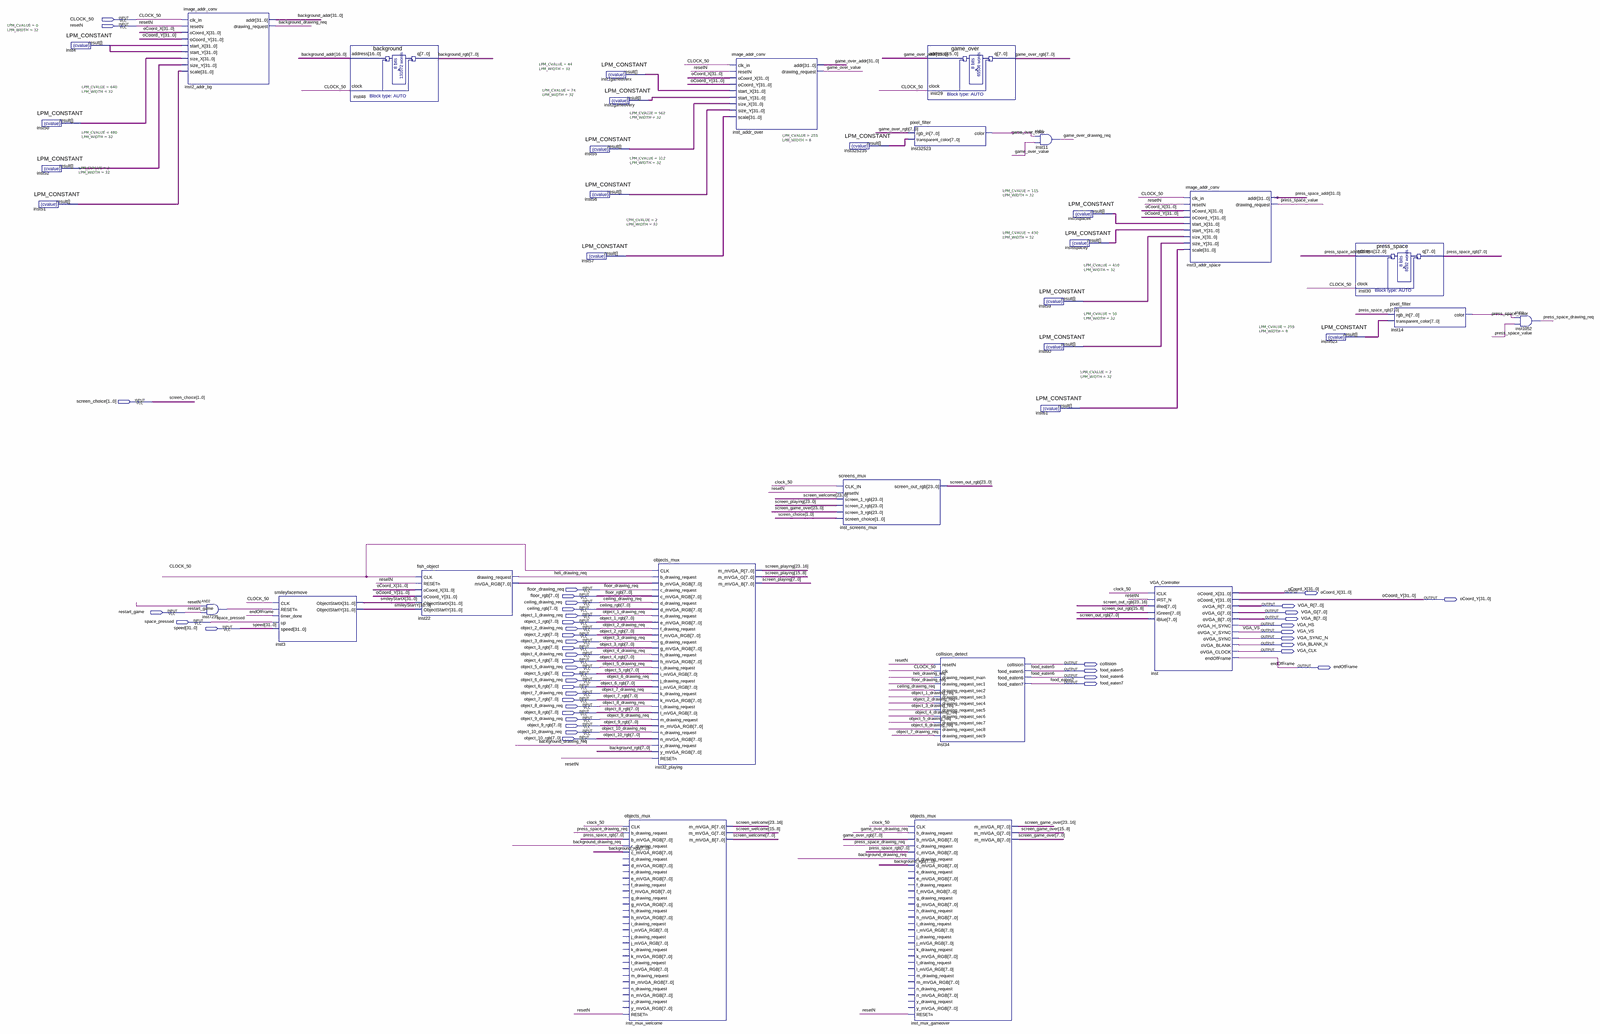
[diagram p0: schematic sheet, whole]
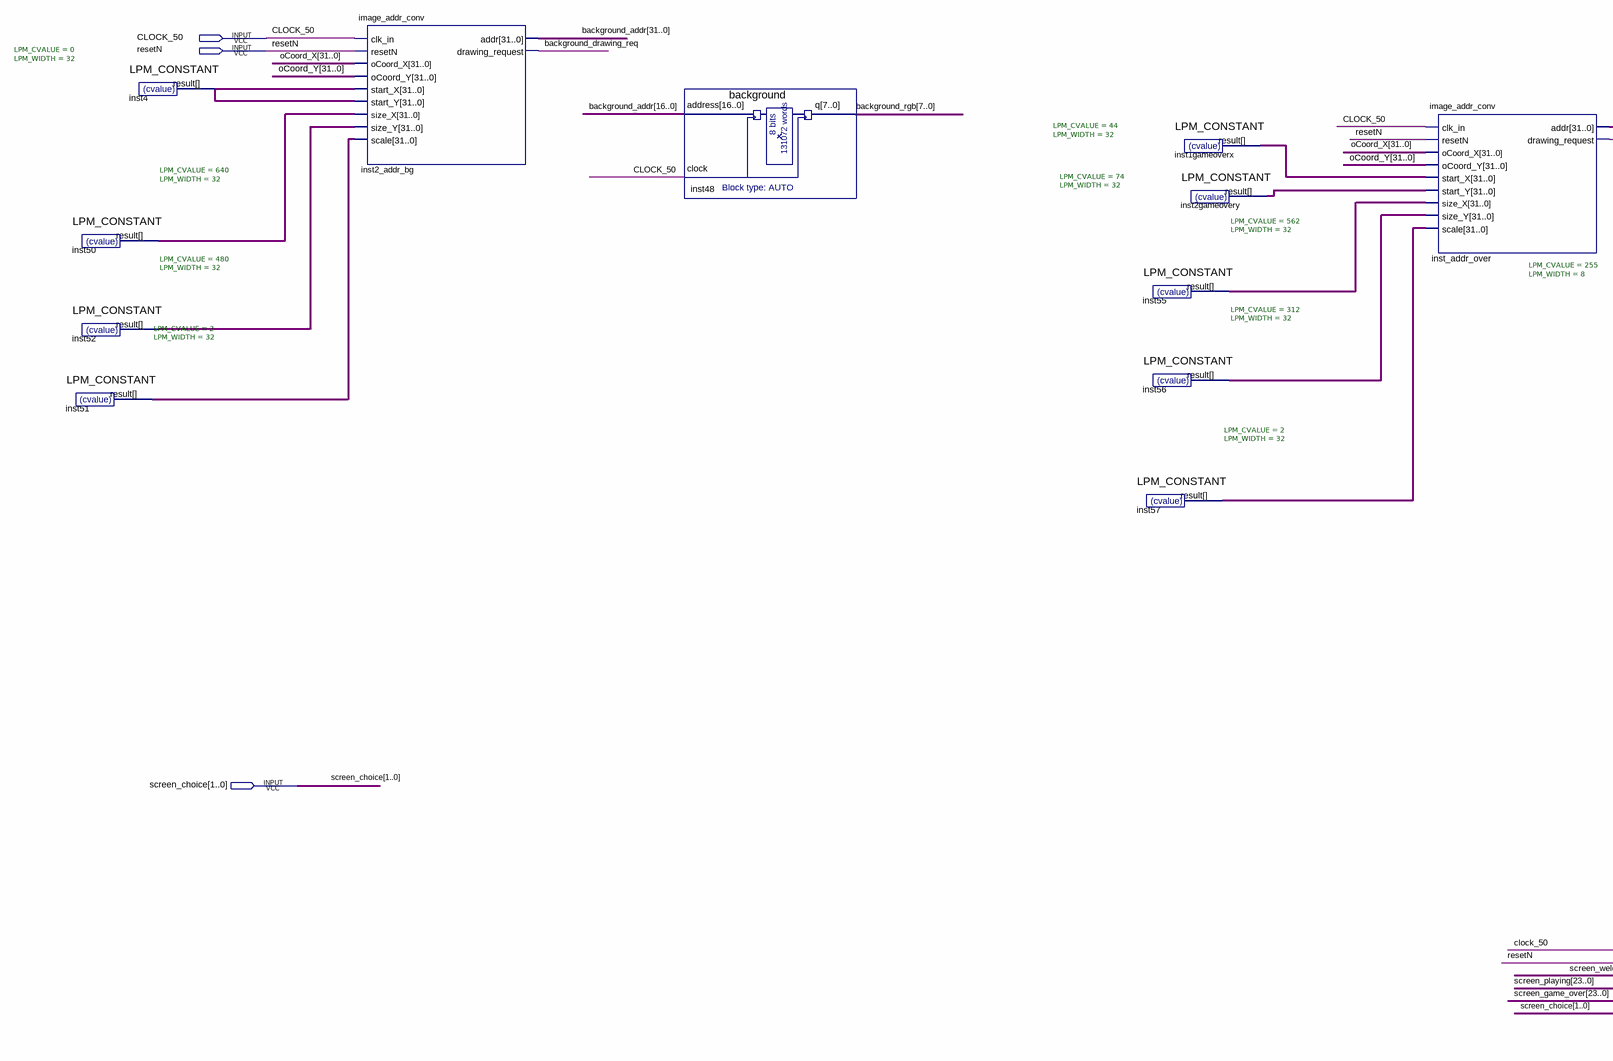
[diagram p1: schematic sheet, upper left part]
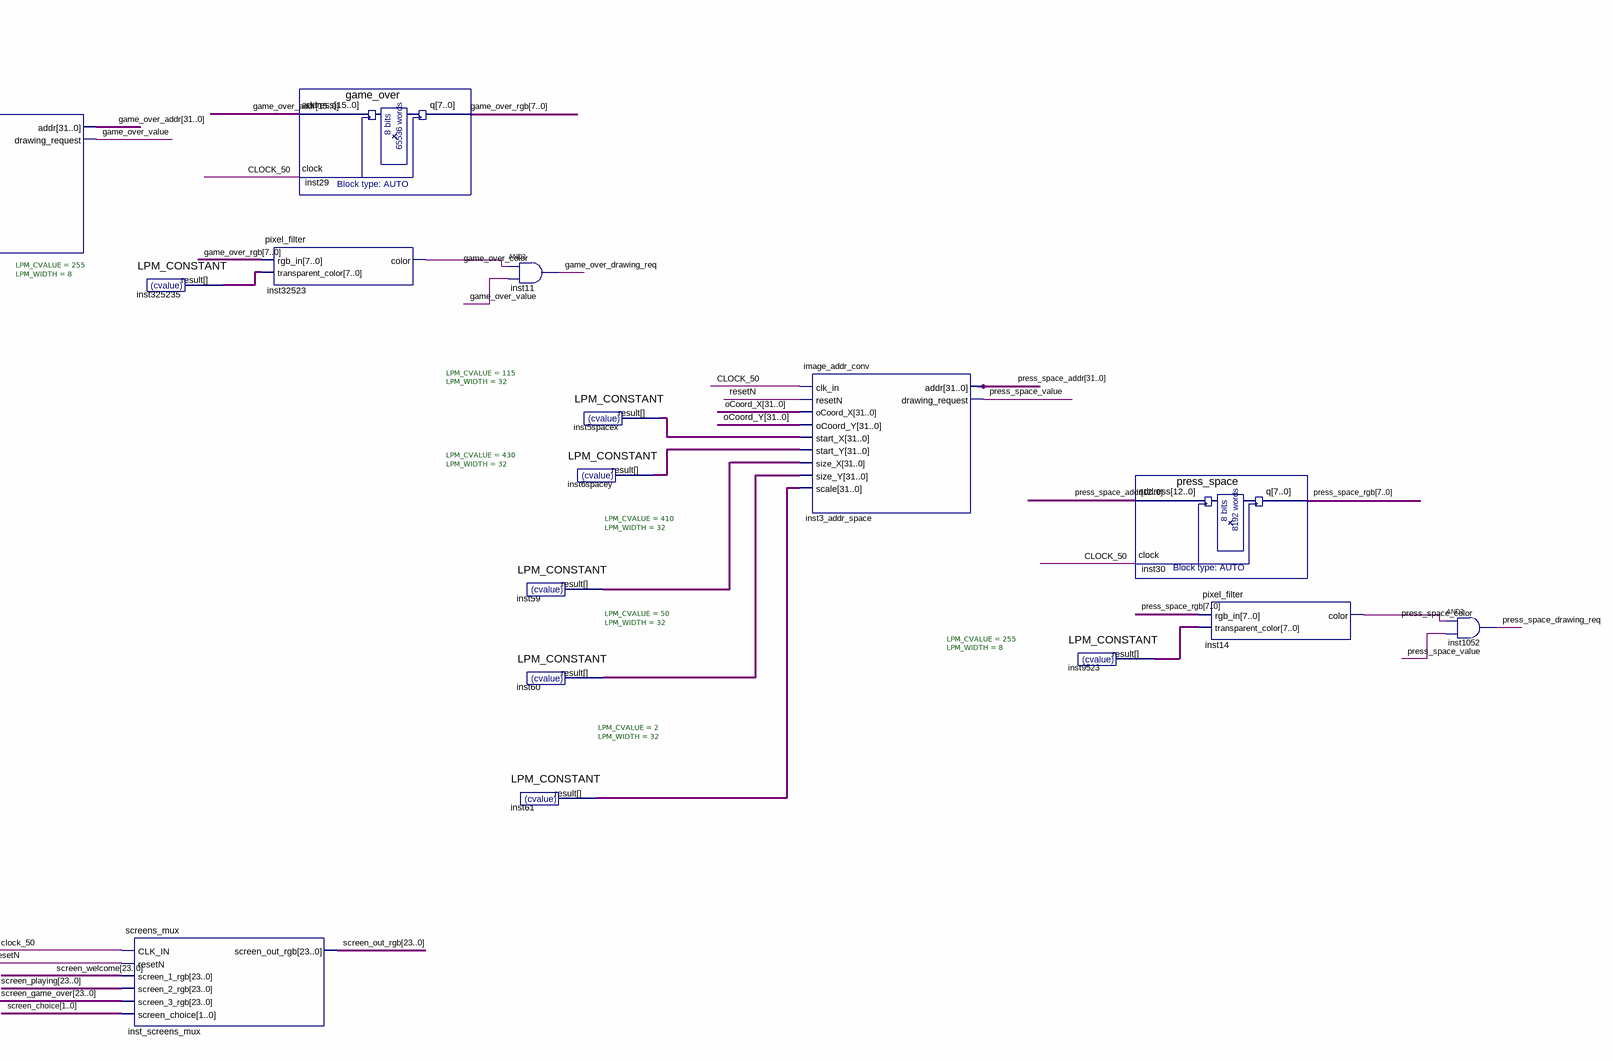
[diagram p2: schematic sheet, upper right part]
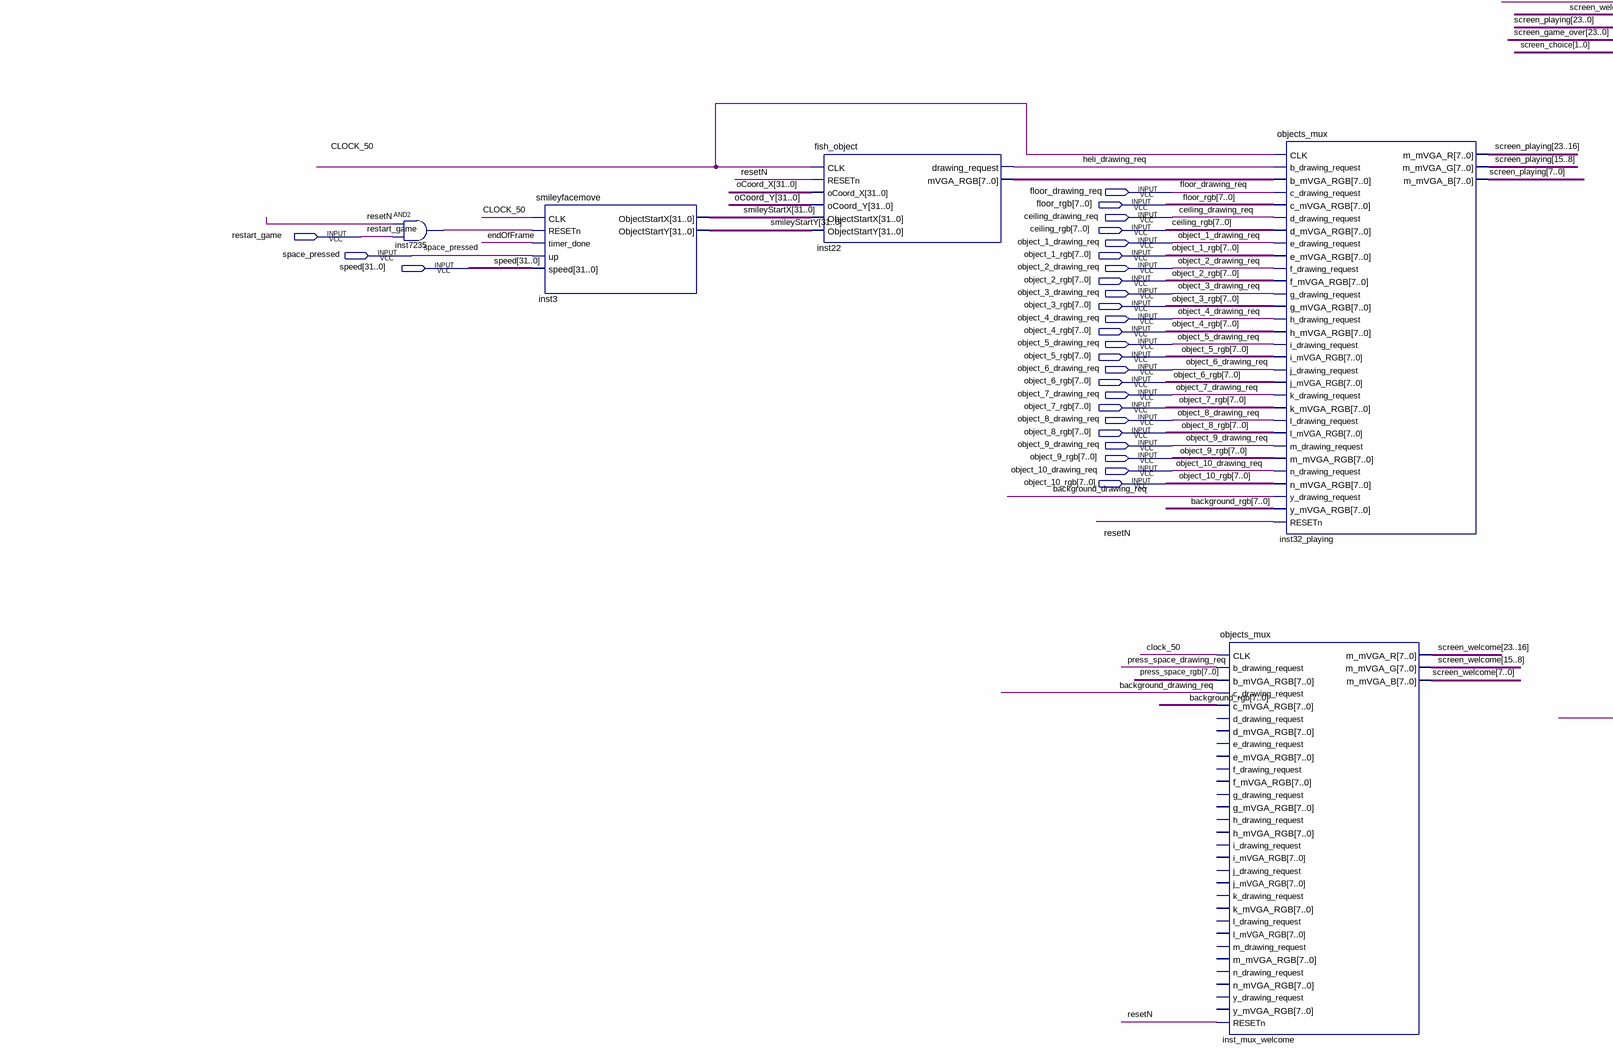
[diagram p3: schematic sheet, lower left part]
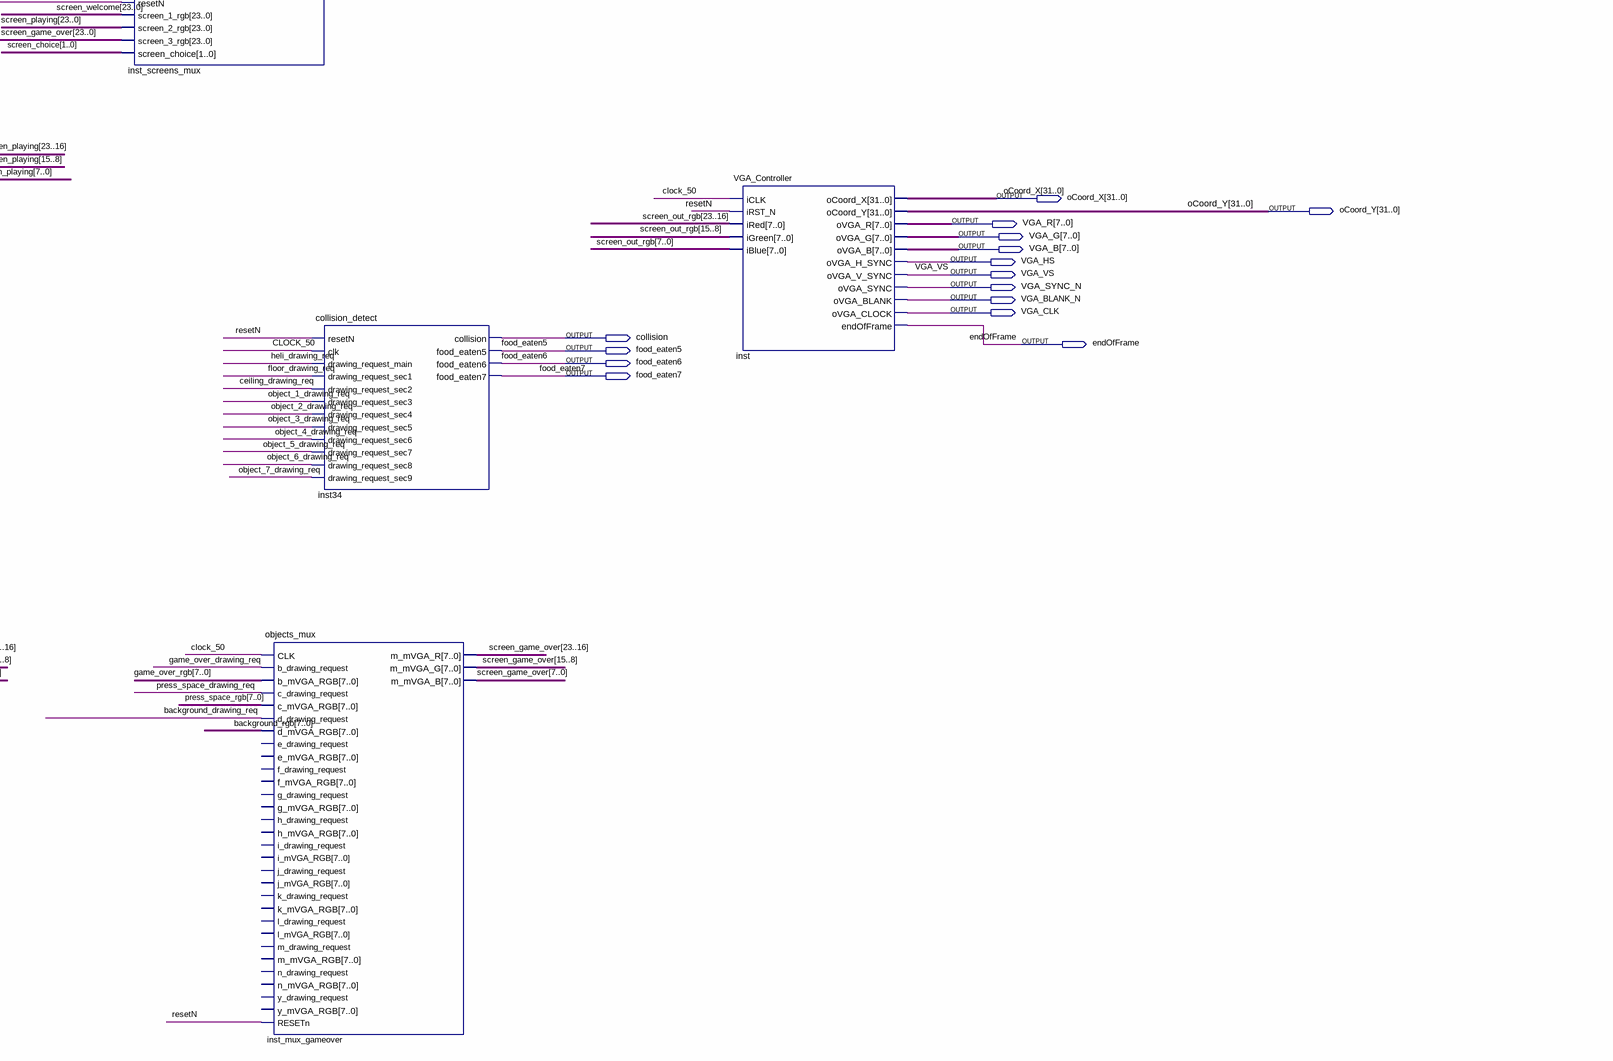
[diagram p4: schematic sheet, lower right part]
// Quartus schematic graphic_top.bdf as structural Verilog: 35 symbols, 45 pins
module graphic_top (
  input  CLOCK_50,
  input  resetN,
  input  [1:0] screen_choice,
  input  floor_drawing_req,
  input  [7:0] floor_rgb,
  input  ceiling_drawing_req,
  input  [7:0] ceiling_rgb,
  input  restart_game,
  input  object_1_drawing_req,
  input  space_pressed,
  input  [7:0] object_1_rgb,
  input  [31:0] speed,
  input  object_2_drawing_req,
  input  [7:0] object_2_rgb,
  input  object_3_drawing_req,
  input  [7:0] object_3_rgb,
  input  object_4_drawing_req,
  input  [7:0] object_4_rgb,
  input  object_5_drawing_req,
  input  [7:0] object_5_rgb,
  input  object_6_drawing_req,
  input  [7:0] object_6_rgb,
  input  object_7_drawing_req,
  input  [7:0] object_7_rgb,
  input  object_8_drawing_req,
  input  [7:0] object_8_rgb,
  input  object_9_drawing_req,
  input  [7:0] object_9_rgb,
  input  object_10_drawing_req,
  input  [7:0] object_10_rgb,
  output [31:0] oCoord_X,
  output [31:0] oCoord_Y,
  output [7:0] VGA_R,
  output [7:0] VGA_G,
  output [7:0] VGA_B,
  output VGA_HS,
  output VGA_VS,
  output VGA_SYNC_N,
  output VGA_BLANK_N,
  output VGA_CLK,
  output collision,
  output endOfFrame,
  output food_eaten5,
  output food_eaten6,
  output food_eaten7
);

  wire background_drawing_req, game_over_color, game_over_drawing_req, game_over_value, heli_drawing_req,
       inst7235_out, press_space_color, press_space_drawing_req, press_space_value;
  wire [7:0] background_rgb, game_over_rgb, inst22_mvga_rgb, inst9523_result, inst325235_result,
       press_space_rgb;
  wire [23:0] screen_game_over, screen_out_rgb, screen_playing, screen_welcome;
  wire [31:0] background_addr, game_over_addr, inst1gameoverx_result, inst2gameovery_result, inst4_result,
       inst5spacex_result, inst6spacey_result, inst50_result, inst51_result, inst52_result, inst55_result,
       inst56_result, inst57_result, inst59_result, inst60_result, inst61_result, press_space_addr,
       smileyStartX, smileyStartY;

  LPM_CONSTANT #(.LPM_CVALUE(640), .LPM_WIDTH(32)) inst50 (.result(inst50_result));
  LPM_CONSTANT #(.LPM_CVALUE(480), .LPM_WIDTH(32)) inst52 (.result(inst52_result));
  LPM_CONSTANT #(.LPM_CVALUE(2), .LPM_WIDTH(32)) inst51 (.result(inst51_result));
  LPM_CONSTANT #(.LPM_CVALUE(0), .LPM_WIDTH(32)) inst4 (.result(inst4_result));
  image_addr_conv inst2_addr_bg (
    .clk_in(CLOCK_50), .resetN(resetN), .oCoord_X(oCoord_X), .oCoord_Y(oCoord_Y), .start_X(inst4_result),
    .start_Y(inst4_result), .size_X(inst50_result), .size_Y(inst52_result), .scale(inst51_result),
    .addr(background_addr), .drawing_request(background_drawing_req));
  and inst7235 (inst7235_out, resetN, restart_game);
  smileyfacemove inst3 (
    .CLK(CLOCK_50), .RESETn(inst7235_out), .timer_done(endOfFrame), .up(space_pressed), .speed(speed),
    .ObjectStartX(smileyStartX), .ObjectStartY(smileyStartY));
  background inst48 (.address(background_addr[16:0]), .clock(CLOCK_50), .q(background_rgb));
  fish_object inst22 (
    .CLK(CLOCK_50), .RESETn(resetN), .oCoord_X(oCoord_X), .oCoord_Y(oCoord_Y), .ObjectStartX(smileyStartX),
    .ObjectStartY(smileyStartY), .drawing_request(heli_drawing_req), .mVGA_RGB(inst22_mvga_rgb));
  LPM_CONSTANT #(.LPM_CVALUE(562), .LPM_WIDTH(32)) inst55 (.result(inst55_result));
  LPM_CONSTANT #(.LPM_CVALUE(312), .LPM_WIDTH(32)) inst56 (.result(inst56_result));
  LPM_CONSTANT #(.LPM_CVALUE(2), .LPM_WIDTH(32)) inst57 (.result(inst57_result));
  LPM_CONSTANT #(.LPM_CVALUE(44), .LPM_WIDTH(32)) inst1gameoverx (.result(inst1gameoverx_result));
  LPM_CONSTANT #(.LPM_CVALUE(74), .LPM_WIDTH(32)) inst2gameovery (.result(inst2gameovery_result));
  objects_mux inst_mux_welcome (
    .CLK(CLOCK_50), .b_drawing_request(press_space_drawing_req), .b_mVGA_RGB(press_space_rgb),
    .c_drawing_request(background_drawing_req), .c_mVGA_RGB(background_rgb), .RESETn(resetN),
    .m_mVGA_R(screen_welcome[23:16]), .m_mVGA_G(screen_welcome[15:8]), .m_mVGA_B(screen_welcome[7:0]));  // open: d_drawing_request, d_mVGA_RGB, e_drawing_request, e_mVGA_RGB, f_drawing_request, f_mVGA_RGB, g_drawing_request, g_mVGA_RGB, h_drawing_request, h_mVGA_RGB, i_drawing_request, i_mVGA_RGB, j_drawing_request, j_mVGA_RGB, k_drawing_request, k_mVGA_RGB, l_drawing_request, l_mVGA_RGB, m_drawing_request, m_mVGA_RGB, n_drawing_request, n_mVGA_RGB, y_drawing_request, y_mVGA_RGB
  objects_mux inst32_playing (
    .CLK(CLOCK_50), .b_drawing_request(heli_drawing_req), .b_mVGA_RGB(inst22_mvga_rgb),
    .c_drawing_request(floor_drawing_req), .c_mVGA_RGB(floor_rgb), .d_drawing_request(ceiling_drawing_req),
    .d_mVGA_RGB(ceiling_rgb), .e_drawing_request(object_1_drawing_req), .e_mVGA_RGB(object_1_rgb),
    .f_drawing_request(object_2_drawing_req), .f_mVGA_RGB(object_2_rgb),
    .g_drawing_request(object_3_drawing_req), .g_mVGA_RGB(object_3_rgb),
    .h_drawing_request(object_4_drawing_req), .h_mVGA_RGB(object_4_rgb),
    .i_drawing_request(object_5_drawing_req), .i_mVGA_RGB(object_5_rgb),
    .j_drawing_request(object_6_drawing_req), .j_mVGA_RGB(object_6_rgb),
    .k_drawing_request(object_7_drawing_req), .k_mVGA_RGB(object_7_rgb),
    .l_drawing_request(object_8_drawing_req), .l_mVGA_RGB(object_8_rgb),
    .m_drawing_request(object_9_drawing_req), .m_mVGA_RGB(object_9_rgb),
    .n_drawing_request(object_10_drawing_req), .n_mVGA_RGB(object_10_rgb),
    .y_drawing_request(background_drawing_req), .y_mVGA_RGB(background_rgb), .RESETn(resetN),
    .m_mVGA_R(screen_playing[23:16]), .m_mVGA_G(screen_playing[15:8]), .m_mVGA_B(screen_playing[7:0]));
  image_addr_conv inst_addr_over (
    .clk_in(CLOCK_50), .resetN(resetN), .oCoord_X(oCoord_X), .oCoord_Y(oCoord_Y),
    .start_X(inst1gameoverx_result), .start_Y(inst2gameovery_result), .size_X(inst55_result),
    .size_Y(inst56_result), .scale(inst57_result), .addr(game_over_addr), .drawing_request(game_over_value));
  LPM_CONSTANT #(.LPM_CVALUE(255), .LPM_WIDTH(8)) inst325235 (.result(inst325235_result));
  screens_mux inst_screens_mux (
    .CLK_IN(CLOCK_50), .resetN(resetN), .screen_1_rgb(screen_welcome), .screen_2_rgb(screen_playing),
    .screen_3_rgb(screen_game_over), .screen_choice(screen_choice), .screen_out_rgb(screen_out_rgb));
  game_over inst29 (.address(game_over_addr[15:0]), .clock(CLOCK_50), .q(game_over_rgb));
  pixel_filter inst32523 (.rgb_in(game_over_rgb), .transparent_color(inst325235_result), .color(game_over_color));
  objects_mux inst_mux_gameover (
    .CLK(CLOCK_50), .b_drawing_request(game_over_drawing_req), .b_mVGA_RGB(game_over_rgb),
    .c_drawing_request(press_space_drawing_req), .c_mVGA_RGB(press_space_rgb),
    .d_drawing_request(background_drawing_req), .d_mVGA_RGB(background_rgb), .RESETn(resetN),
    .m_mVGA_R(screen_game_over[23:16]), .m_mVGA_G(screen_game_over[15:8]), .m_mVGA_B(screen_game_over[7:0]));  // open: e_drawing_request, e_mVGA_RGB, f_drawing_request, f_mVGA_RGB, g_drawing_request, g_mVGA_RGB, h_drawing_request, h_mVGA_RGB, i_drawing_request, i_mVGA_RGB, j_drawing_request, j_mVGA_RGB, k_drawing_request, k_mVGA_RGB, l_drawing_request, l_mVGA_RGB, m_drawing_request, m_mVGA_RGB, n_drawing_request, n_mVGA_RGB, y_drawing_request, y_mVGA_RGB
  collision_detect inst34 (
    .resetN(resetN), .clk(CLOCK_50), .drawing_request_main(heli_drawing_req),
    .drawing_request_sec1(floor_drawing_req), .drawing_request_sec2(ceiling_drawing_req),
    .drawing_request_sec3(object_1_drawing_req), .drawing_request_sec4(object_2_drawing_req),
    .drawing_request_sec5(object_3_drawing_req), .drawing_request_sec6(object_4_drawing_req),
    .drawing_request_sec7(object_5_drawing_req), .drawing_request_sec8(object_6_drawing_req),
    .drawing_request_sec9(object_7_drawing_req), .collision(collision), .food_eaten5(food_eaten5),
    .food_eaten6(food_eaten6), .food_eaten7(food_eaten7));
  and inst11 (game_over_drawing_req, game_over_color, game_over_value);
  LPM_CONSTANT #(.LPM_CVALUE(410), .LPM_WIDTH(32)) inst59 (.result(inst59_result));
  LPM_CONSTANT #(.LPM_CVALUE(50), .LPM_WIDTH(32)) inst60 (.result(inst60_result));
  LPM_CONSTANT #(.LPM_CVALUE(2), .LPM_WIDTH(32)) inst61 (.result(inst61_result));
  LPM_CONSTANT #(.LPM_CVALUE(115), .LPM_WIDTH(32)) inst5spacex (.result(inst5spacex_result));
  LPM_CONSTANT #(.LPM_CVALUE(430), .LPM_WIDTH(32)) inst6spacey (.result(inst6spacey_result));
  VGA_Controller inst (
    .iCLK(CLOCK_50), .iRST_N(resetN), .iRed(screen_out_rgb[23:16]), .iGreen(screen_out_rgb[15:8]),
    .iBlue(screen_out_rgb[7:0]), .oCoord_X(oCoord_X), .oCoord_Y(oCoord_Y), .oVGA_R(VGA_R), .oVGA_G(VGA_G),
    .oVGA_B(VGA_B), .oVGA_H_SYNC(VGA_HS), .oVGA_V_SYNC(VGA_VS), .oVGA_SYNC(VGA_SYNC_N),
    .oVGA_BLANK(VGA_BLANK_N), .oVGA_CLOCK(VGA_CLK), .endOfFrame(endOfFrame));
  image_addr_conv inst3_addr_space (
    .clk_in(CLOCK_50), .resetN(resetN), .oCoord_X(oCoord_X), .oCoord_Y(oCoord_Y),
    .start_X(inst5spacex_result), .start_Y(inst6spacey_result), .size_X(inst59_result),
    .size_Y(inst60_result), .scale(inst61_result), .addr(press_space_addr),
    .drawing_request(press_space_value));
  LPM_CONSTANT #(.LPM_CVALUE(255), .LPM_WIDTH(8)) inst9523 (.result(inst9523_result));
  press_space inst30 (.address(press_space_addr[12:0]), .clock(CLOCK_50), .q(press_space_rgb));
  pixel_filter inst14 (.rgb_in(press_space_rgb), .transparent_color(inst9523_result), .color(press_space_color));
  and inst1052 (press_space_drawing_req, press_space_color, press_space_value);
endmodule
